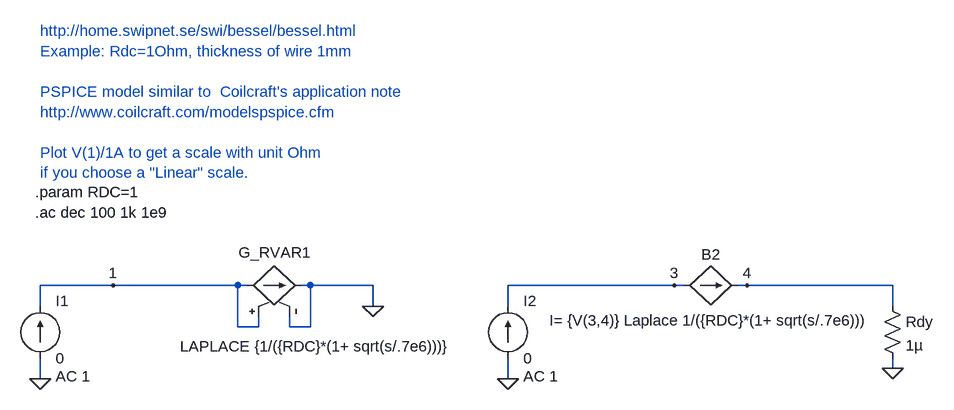
[diagram p0: schematic skin_effect2.asc]
skin_effect2.asc, the LTspice schematic file:
Version 4
SHEET 1 1428 680
WIRE -192 224 -304 224
WIRE 0 224 -192 224
WIRE 16 224 0 224
WIRE 112 224 96 224
WIRE 208 224 112 224
WIRE 672 224 416 224
WIRE 688 224 672 224
WIRE 784 224 768 224
WIRE 1008 224 784 224
WIRE -304 256 -304 224
WIRE 208 256 208 224
WIRE 416 256 416 224
WIRE 1008 256 1008 224
WIRE 0 288 0 224
WIRE 32 288 32 272
WIRE 32 288 0 288
WIRE 80 288 80 272
WIRE 112 288 112 224
WIRE 112 288 80 288
WIRE 1008 352 1008 336
WIRE -304 368 -304 336
WIRE 416 368 416 336
FLAG -304 368 0
FLAG 208 256 0
FLAG -192 224 1
FLAG 416 368 0
FLAG 1008 352 0
FLAG 672 224 3
FLAG 784 224 4
SYMBOL current -304 336 M180
WINDOW 0 24 88 Left 0
WINDOW 3 24 0 Left 0
WINDOW 123 24 -28 Left 0
WINDOW 39 0 0 Left 0
SYMATTR InstName I1
SYMATTR Value 0
SYMATTR Value2 AC 1
SYMBOL g2 112 224 M270
WINDOW 0 51 111 VLeft 0
WINDOW 3 -94 201 VLeft 0
SYMATTR InstName G_RVAR1
SYMATTR Value LAPLACE {1/({RDC}*(1+ sqrt(s/.7e6)))}
SYMBOL bi 688 224 R270
WINDOW 0 32 40 VTop 0
WINDOW 3 -38 40 VBottom 0
SYMATTR InstName B2
SYMATTR Value I= {V(3,4)} Laplace 1/({RDC}*(1+ sqrt(s/.7e6)))
SYMBOL current 416 336 M180
WINDOW 0 24 88 Left 0
WINDOW 3 24 0 Left 0
WINDOW 123 24 -28 Left 0
WINDOW 39 0 0 Left 0
SYMATTR InstName I2
SYMATTR Value 0
SYMATTR Value2 AC 1
SYMBOL res 992 240 R0
SYMATTR InstName Rdy
SYMATTR Value 1µ
TEXT -312 112 Left 0 !.ac dec 100 1k 1e9
TEXT -304 -168 Left 0 ;http://home.swipnet.se/swi/bessel/bessel.html\nExample: Rdc=1Ohm, thickness of wire 1mm\n \nPSPICE model similar to  Coilcraft's application note\nhttp://www.coilcraft.com/modelspspice.cfm\n \nPlot V(1)/1A to get a scale with unit Ohm\nif you choose a "Linear" scale.
TEXT -312 80 Left 0 !.param RDC=1

The netlist it stands for:
* skin_effect2.asc
I1 0 1 0 AC 1
G_RVAR1 1 0 1 0 LAPLACE {1/({RDC}*(1+ sqrt(s/.7e6)))}
B2 3 4 I= {V(3,4)} Laplace 1/({RDC}*(1+ sqrt(s/.7e6)))
I2 0 3 0 AC 1
Rdy 4 0 1µ
.ac dec 100 1k 1e9
* http://home.swipnet.se/swi/bessel/bessel.html
* Example: Rdc=1Ohm, thickness of wire 1mm
* PSPICE model similar to  Coilcraft's application note
* http://www.coilcraft.com/modelspspice.cfm
* Plot V(1)/1A to get a scale with unit Ohm
* if you choose a "Linear" scale.
.param RDC=1
.backanno
.end